# EAGLE design Schematic transporter (EAGLE 9.6.2)
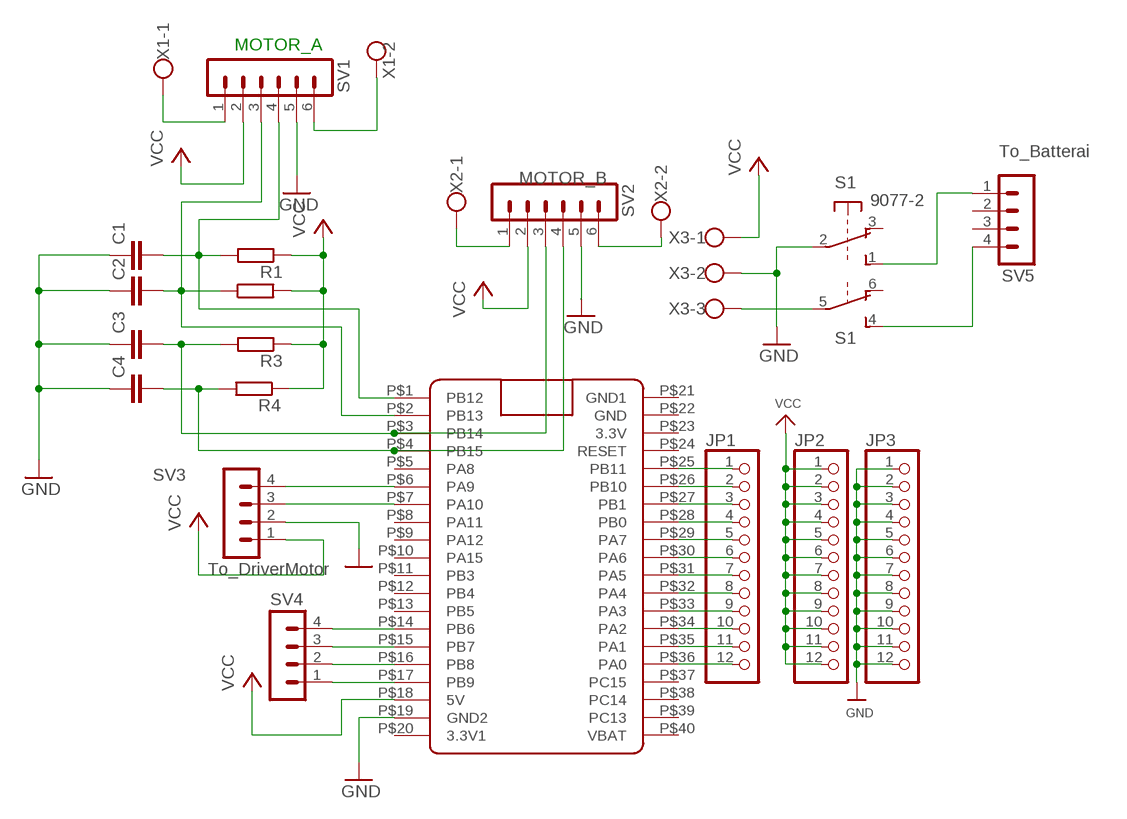
[diagram p0: schematic, sheet 1]

## Parts
C1  C-EU050-024X044  [C050-024X044]
C2  C-EU050-024X044  [C050-024X044]
C3  C-EU050-024X044  [C050-024X044]
C4  C-EU050-024X044  [C050-024X044]
JP1  PINHD-1X12  [1X12]
JP2  PINHD-1X12  [1X12]
JP3  PINHD-1X12  [1X12]
R1  R-EU_0207/7  [0207/7]
R2  R-EU_0207/7  [0207/7]
R3  R-EU_0207/7  [0207/7]
R4  R-EU_0207/7  [0207/7]
S1  9077-2  [9077-2]
SV1  MA06-1  [MA06-1]
SV2  MA06-1  [MA06-1]
SV3  MA04-1  [MA04-1]
SV4  MA04-1  [MA04-1]
SV5  MA04-1  [MA04-1]
U$1  BLUE_PILL  [BLUE_PILL]
X1  W237-102  [W237-102]
X2  W237-102  [W237-102]
X3  W237-103  [W237-103]

## Nets
GND: C1.1 C2.1 C3.1 C4.1 JP3.1 JP3.2 JP3.3 JP3.4 JP3.5 JP3.6 JP3.7 JP3.8 JP3.9 JP3.10 JP3.11 JP3.12 S1.2(1:P) SV1.5 SV2.5 SV3.2 U$1.P$19(GND2) X3.2
N$1: JP1.1 U$1.P$25(PB11)
N$2: JP1.2 U$1.P$26(PB10)
N$3: JP1.3 U$1.P$27(PB1)
N$4: JP1.4 U$1.P$28(PB0)
N$5: JP1.5 U$1.P$29(PA7)
N$6: JP1.6 U$1.P$30(PA6)
N$7: JP1.7 U$1.P$31(PA5)
N$8: JP1.8 U$1.P$32(PA4)
N$9: JP1.9 U$1.P$33(PA3)
N$10: JP1.10 U$1.P$34(PA2)
N$11: JP1.11 U$1.P$35(PA1)
N$12: JP1.12 U$1.P$36(PA0)
N$13: C1.2 R1.2 SV1.4 U$1.P$1(PB12)
N$14: C2.2 R2.1 SV1.3 U$1.P$2(PB13)
N$15: C3.2 R3.2 SV2.3 U$1.P$3(PB14)
N$16: C4.2 R4.2 SV2.4 U$1.P$4(PB15)
N$17: SV3.4 U$1.P$6(PA9)
N$18: SV3.3 U$1.P$7(PA10)
N$19: SV4.4 U$1.P$14(PB6)
N$20: SV2.6 X2.2
N$21: SV1.1 X1.1
N$22: SV2.1 X2.1
N$23: SV1.6 X1.2
N$24: SV4.3 U$1.P$15(PB7)
N$25: SV4.2 U$1.P$16(PB8)
N$26: SV4.1 U$1.P$17(PB9)
N$30: S1.5(2:P) X3.3
N$31: S1.1(1:S) SV5.1
N$32: S1.4(2:S) SV5.4
VCC: JP2.1 JP2.2 JP2.3 JP2.4 JP2.5 JP2.6 JP2.7 JP2.8 JP2.9 JP2.10 JP2.11 JP2.12 R1.1 R2.2 R3.1 R4.1 SV1.2 SV2.2 SV3.1 U$1.P$18(5V) X3.1
Unconnected: S1.3(1:O) S1.6(2:O) SV5.2 SV5.3 U$1.P$5(PA8) U$1.P$8(PA11) U$1.P$9(PA12) U$1.P$10(PA15) U$1.P$11(PB3) U$1.P$12(PB4) U$1.P$13(PB5) U$1.P$20(3.3V1) U$1.P$22(GND) U$1.P$23(3.3V) U$1.P$24(RESET) U$1.P$37(PC15) U$1.P$38(PC14) U$1.P$39(PC13) U$1.P$40(VBAT)

## Notes on the sheet
- MOTOR_A
- To_Batterai
- MOTOR_B
- To_DriverMotor

## Power pins joined to a net without a drawn wire
GND1: U$1.P$21(GND1)

## Library data of the parts
C1-C4 = rcl:C-EU: CAPACITOR, European symbol; SPICEPREFIX: C
JP1-JP3 = Connector:PINHD-1X12: PIN HEADER; CATEGORY: CONNECTOR; SUB-CATEGORY: PIN-HEADER
R1-R4 = rcl:R-EU_: RESISTOR, European symbol; SPICEPREFIX: R
S1 = switch-misc:9077-2: MARQUARDT SWITCH 9077.0200 Distributor: Buerklin <https://www.buerklin.com/default.asp?event=ShowArtikel%2812G2822%29&l=d&jump=ArtNr_12G2822>
SV1 SV2 = con-lstb:MA06-1: PIN HEADER; OC_FARNELL: unknown; OC_NEWARK: unknown
SV3-SV5 = con-lstb:MA04-1: PIN HEADER; OC_FARNELL: unknown; OC_NEWARK: unknown
U$1 = BluePill:BLUE_PILL
X1 X2 = con-wago-500:W237-102: WAGO SCREW CLAMP; MPN: 237-102; OC_FARNELL: unknown; OC_NEWARK: 70K9898
X3 = con-wago-500:W237-103: WAGO SCREW CLAMP; MPN: 237-103; OC_FARNELL: unknown; OC_NEWARK: 18M7116

## Board
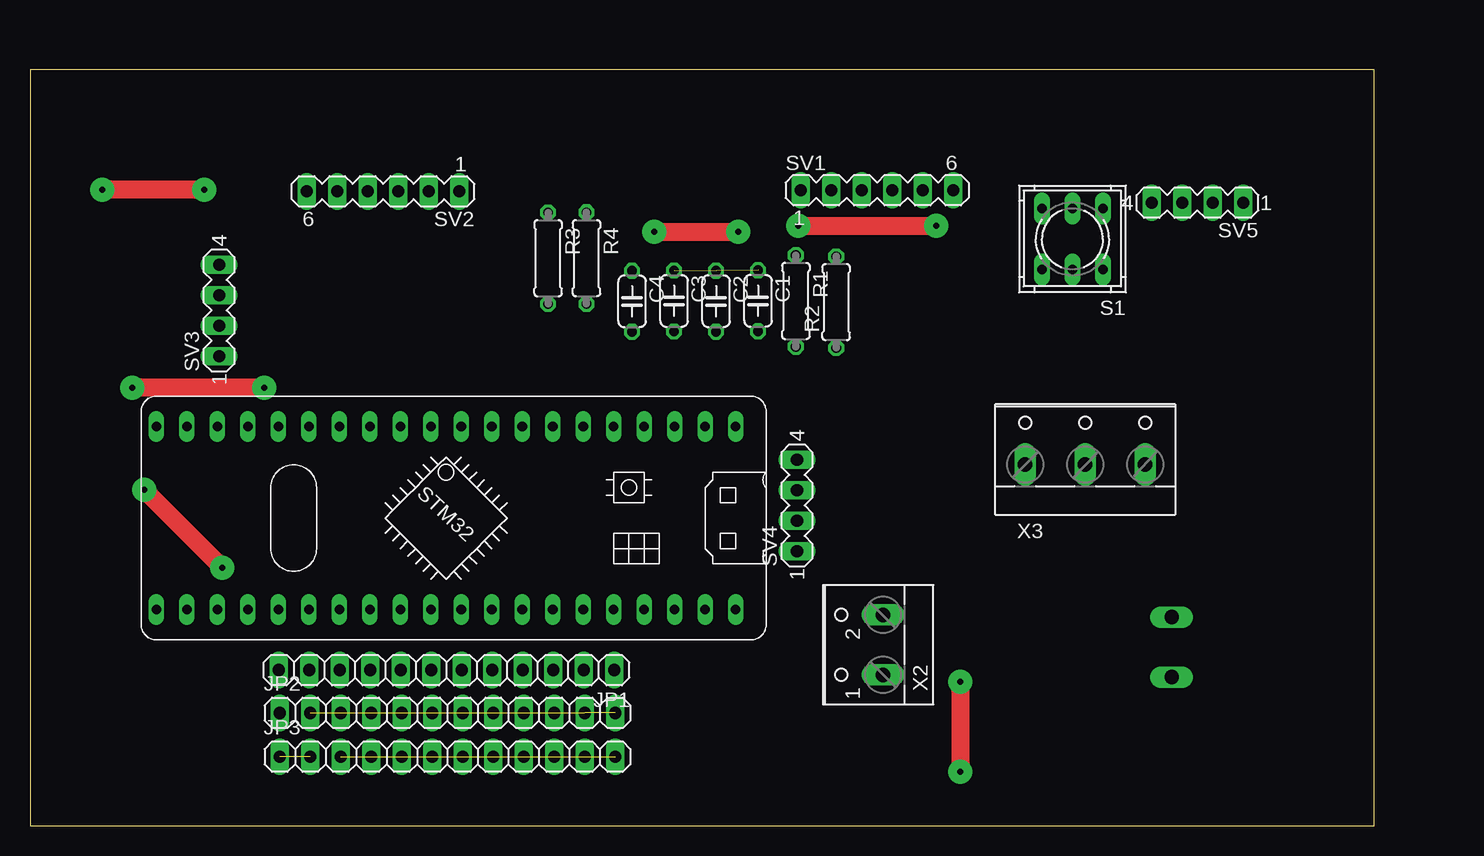
[diagram p1: board, top side]
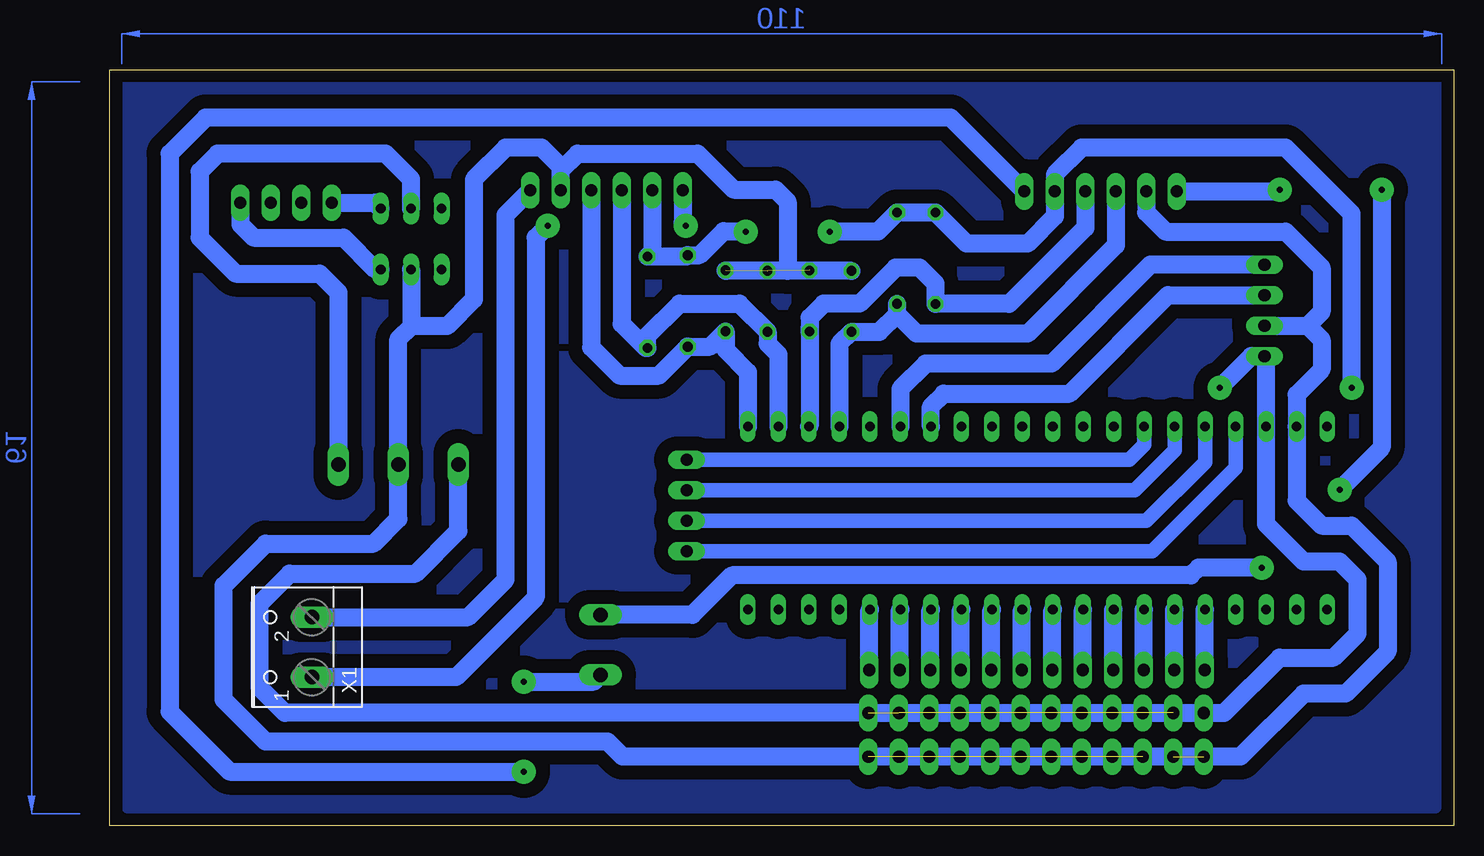
[diagram p2: board, bottom side, seen from below]

Size 112 x 63 mm. Coordinates in mm from the lower left corner, seen from the top.
Outline: 0,0 112,0 112,63 0,63 0,0
Copper layers (1*16): Top 0.035mm / dielectric 1.5mm / Bottom 0.035mm
Design rules "default *": minimum track width 6mil, minimum drill 0.35mm, track to track 46mil, track to pad 46mil, pad to pad 6mil, via to via 6mil, smd to smd 6mil, copper to edge 40mil, drill to drill 6mil, minimum pad ring 10mil, minimum via ring 8mil, stop-mask expansion 4mil, vias tented up to drill 0mil, thermal gap 10mil

### Footprints (pad centres in the part's own frame; a part is rotated, then mirrored left to right if it is on the bottom)
C050-024X044 = drill 0.813 octagon: 1 -2.54,0; 2 2.54,0
1X12 = drill 1.016 long: 1 -13.97,0; 2 -11.43,0; 3 -8.89,0; 4 -6.35,0; 5 -3.81,0; 6 -1.27,0; 7 1.27,0; 8 3.81,0; 9 6.35,0; 10 8.89,0; 11 11.43,0; 12 13.97,0
0207/7 = drill 0.813 octagon: 1 -3.81,0; 2 3.81,0
9077-2 = drill 0.813 long: 1 -2.54,2.54; 2 0,2.54; 3 2.54,2.54; 4 -2.54,-2.54; 5 0,-2.54; 6 2.54,-2.54
MA06-1 = drill 1.016 long: 1 -6.35,0; 2 -3.81,0; 3 -1.27,0; 4 1.27,0; 5 3.81,0; 6 6.35,0
MA04-1 = drill 1.016 long: 1 -3.81,0; 2 -1.27,0; 3 1.27,0; 4 3.81,0
BLUE_PILL = drill 0.8 long: P$1 -7.62,15.24; P$2 -7.62,12.7; P$3 -7.62,10.16; P$4 -7.62,7.62; P$5 -7.62,5.08; P$6 -7.62,2.54; P$7 -7.62,0; P$8 -7.62,-2.54; P$9 -7.62,-5.08; P$10 -7.62,-7.62; P$11 -7.62,-10.16; P$12 -7.62,-12.7; P$13 -7.62,-15.24; P$14 -7.62,-17.78; P$15 -7.62,-20.32; P$16 -7.62,-22.86; P$17 -7.62,-25.4; P$18 -7.62,-27.94; P$19 -7.62,-30.48; P$20 -7.62,-33.02; P$21 7.62,15.24; P$22 7.62,12.7; P$23 7.62,10.16; P$24 7.62,7.62; P$25 7.62,5.08; P$26 7.62,2.54; P$27 7.62,0; P$28 7.62,-2.54; P$29 7.62,-5.08; P$30 7.62,-7.62; P$31 7.62,-10.16; P$32 7.62,-12.7; P$33 7.62,-15.24; P$34 7.62,-17.78; P$35 7.62,-20.32; P$36 7.62,-22.86; P$37 7.62,-25.4; P$38 7.62,-27.94; P$39 7.62,-30.48; P$40 7.62,-33.02
W237-102 = drill 1.194 long: 1 -2.5,-1.27; 2 2.5,-1.27
W237-103 = drill 1.194 long: 1 -5,-1.29; 2 0,-1.29; 3 5,-1.29

### Placement (x,y rotation side)
C1  60.67,43.73 270 top
C2  57.17,43.7 270 top
C3  53.67,43.72 270 top
C4  50.17,43.69 270 top
JP1  34.71,12.96 180 top
JP2  34.79,9.39 0 top
JP3  34.79,5.74 0 top
R1  63.82,43.72 270 top
R2  67.18,43.62 90 top
R3  43.17,47.28 270 top
R4  46.37,47.29 270 top
S1  86.87,48.88 180 top
SV1  70.59,52.95 0 top
SV2  29.42,52.85 180 top
SV3  15.76,42.93 90 top
SV4  63.91,26.68 90 top
SV5  97.29,51.91 180 top
U$1  43.56,25.63 270 top
X1  96.41,14.87 90 bottom
X2  69.81,15.06 90 top
X3  87.93,31.39 0 top

### Tracks (layer width: path | path; a pad name or v marks a point on that pad's centre or on a via)
GND  (12 unrouted)
  Bottom 1.5: C4.1 55.5,46.23 | 55.5,46.23 60.63,46.23 C1.1 | SV3.2 12.16,41.66 | 12.16,41.66 11,40.5 11,38 13.08,35.92 U$1.P$19 13.08,27.08 11,25 8.5,25 5.5,22 5.5,14.5 9,11 12.5,11 17.76,5.74 JP3.1 JP3.12 69.24,5.74 70.5,7 99,7 102.5,10.5 102.5,20 99,23.5 90,23.5 87.93,25.57 X3.2 87.93,40.57 86.87,41.63 | SV2.5 25.61,51.11 24,49.5 14,49.5 11,46.5 11,42.82 12.16,41.66 | S1.2 86.87,41.63 | 86.87,41.63 83.87,41.63 81.65,43.85 81.65,53.85 79,56.5 76,56.5 74.4,54.9 SV1.5 74.4,54.6 73,56 63,56 60,53 56.5,53 55.5,52 55.5,46.23
N$1
  Bottom 1.5: JP1.1 48.68,17.97 U$1.P$25
N$2
  Bottom 1.5: JP1.2 46.14,17.97 U$1.P$26
N$3
  Bottom 1.5: JP1.3 43.6,17.97 U$1.P$27
N$4
  Bottom 1.5: JP1.4 41.06,17.97 U$1.P$28
N$5
  Bottom 1.5: JP1.5 38.52,17.97 U$1.P$29
N$6
  Bottom 1.5: JP1.6 35.98,17.97 U$1.P$30
N$7
  Bottom 1.5: JP1.7 33.44,17.97 U$1.P$31
N$8
  Bottom 1.5: JP1.8 30.9,17.97 U$1.P$32
N$9
  Bottom 1.5: JP1.9 28.36,17.97 U$1.P$33
N$10
  Bottom 1.5: JP1.10 25.82,17.97 U$1.P$34
N$11
  Bottom 1.5: JP1.11 23.28,17.97 U$1.P$35
N$12
  Bottom 1.5: JP1.12 20.74,17.97 U$1.P$36
N$13
  Bottom 1.5: U$1.P$1 58.8,37.8 60.67,39.67 C1.2 61.95,39.91 R1.2 66.23,37.5 69.5,37.5 71.86,39.86 SV1.4
N$14
  Bottom 1.5: U$1.P$2 56.26,39.26 57.17,40.17 C2.2 59.51,43.5 64.5,43.5 67.18,40.82 R2.1 67.31,39.81 69.32,41.82 SV1.3
N$15
  Bottom 1.5: C3.2 53.67,33.3 U$1.P$3 | 53.67,41.48 C3.2 | C3.2 53.67,42.33 52.5,43.5 49.5,43.5 46.5,46.5 44.5,46.5 43.17,45.17 R3.2 37.03,43.47 30.69,49.81 SV2.3
N$16
  Bottom 1.5: 46.37,42.63 R4.2 | 46.37,42.63 47.85,41.15 C4.2 51.18,40.14 U$1.P$4 | SV2.4 28.15,48.35 35.5,41 44.74,41 46.37,42.63
N$17
  Bottom 1.5: SV3.4 25.26,46.74 33.5,38.5 44,38.5 46.1,36.4 U$1.P$6
N$18
  Bottom 1.5: U$1.P$7 43.56,34.94 42.5,36 32,36 23.8,44.2 SV3.3
N$19
  Bottom 1.2: SV4.4 27.01,30.49 25.78,31.72 U$1.P$14
N$20  (via drill 0.5 pad 2)
  Top 1.5: v14.5,53 v6,53 | v9.5,28 v16,21.5
  Bottom 1.5: SV2.6 14.65,52.85 v14.5,53 | v6,53 6,31.5 v9.5,28 | X2.2 63.44,17.56 60.15,20.85 21.9,20.85 21.25,21.5 v16,21.5
N$21  (via drill 0.5 pad 2)
  Top 1.5: v64,50 v75.5,50
  Bottom 1.5: SV1.1 64.24,50.24 v64,50 | v75.5,50 76.5,49 76.5,19 83.13,12.37 X1.1
N$22  (via drill 0.5 pad 2)
  Top 1.5: v77.5,12 v77.5,4.5
  Bottom 1.5: SV2.1 41.92,59 104,59 107,56 107,9.5 102,4.5 v77.5,4.5 | v77.5,12 71.64,12 X2.1
N$23
  Bottom 1.5: X1.2 82.13,17.37 79,20.5 79,50.89 SV1.6
N$24
  Bottom 1.2: U$1.P$15 23.24,31.26 26.55,27.95 SV4.3
N$25
  Bottom 1.2: SV4.2 25.59,25.41 20.7,30.3 U$1.P$16
N$26
  Bottom 1.2: U$1.P$17 18.16,29.84 25.13,22.87 SV4.1
N$30
  Bottom 1.5: S1.5 86.87,53.87 89,56 103,56 104.5,54.5 104.5,49 101.5,46 94.5,46 92.93,44.43 X3.3
N$31
  Bottom 1.5: SV5.1 101.1,50.1 100,49 92.5,49 89.84,46.34 S1.1
N$32
  Bottom 1.5: 89.49,51.5 S1.4 89.9,51.91 SV5.4
SS
  pour Bottom: 1.5,62.5 110.5,62.5 110.5,3.5 110.5,1.5 14.5,1.5 1.5,1.5
VCC  (via drill 0.5 pad 2)  (10 unrouted)
  Top 1.5: v52,49.5 v59,49.5 | v19.5,36.5 v8.5,36.5
  Bottom 1.5: SV1.2 66.78,47.83 R2.2 63.92,47.43 R1.1 62.82,47.53 60.82,49.53 59.03,49.53 v59,49.5 | v52,49.5 47.97,49.5 R4.1 R3.1 40.58,48.5 35.5,48.5 33.23,50.77 SV2.2 33.23,54.27 31,56.5 14,56.5 8.5,51 v8.5,36.5 | v19.5,36.5 16.88,39.12 SV3.1 15.62,38.98 U$1.P$18 15.62,25.12 12.5,22 9.5,22 8,20.5 8,16 10,14 14.5,14 19.11,9.39 JP2.1 JP2.12 97.39,9.39 99.5,11.5 99.5,18.5 97,21 86.5,21 82.93,24.57 X3.1
(copper drawn outside any net)
  shapes: Bottom area x2